# Altium schematic sheet solenoid.SchDoc
size A4
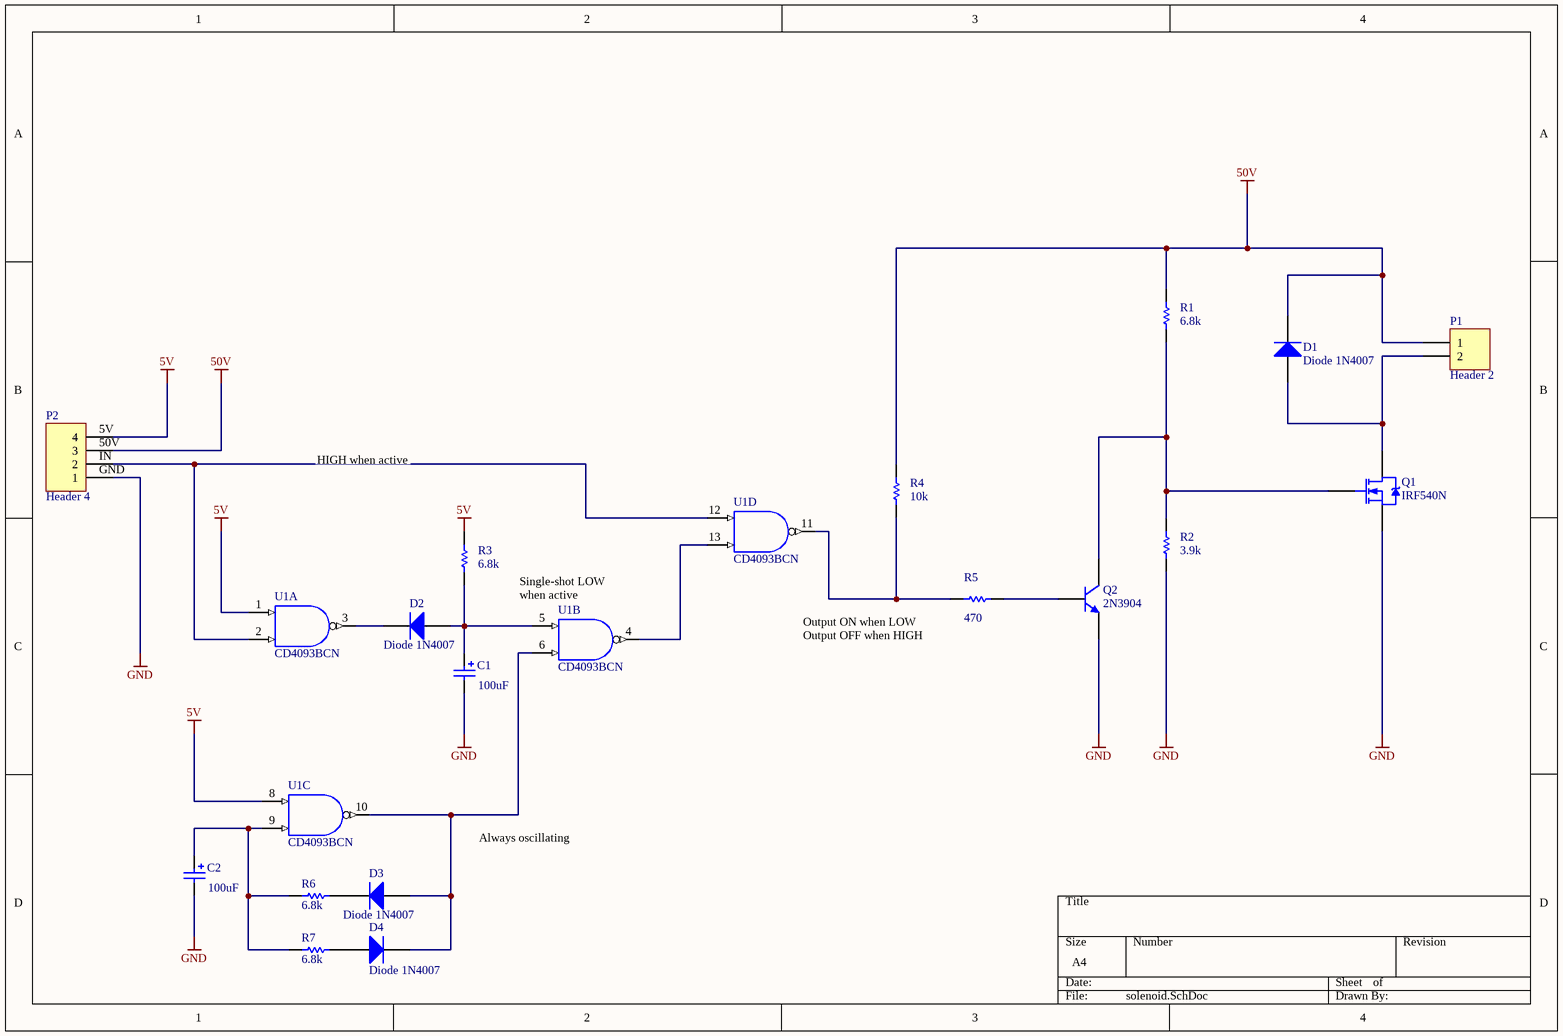
[diagram p0: solenoid.SchDoc]

## Parts
C1  value 100uF  [POLAR0.8]  (hidden comment: Cap Pol2)
C2  value 100uF  [POLAR0.8]  (hidden comment: Cap Pol2)
D1  Diode 1N4007  [DO-41]
D2  Diode 1N4007  [DO-41]
D3  Diode 1N4007  [DO-41]
D4  Diode 1N4007  [DO-41]
P1  Header 2  [HDR1X2]
P2  Header 4  [HDR1X4]
Q1  IRF540N  [TO-220AB]
Q2  2N3904  [TO-92A]
R1  value 6.8k  [AXIAL-0.3]  (hidden comment: Res1)
R2  value 3.9k  [AXIAL-0.3]  (hidden comment: Res1)
R3  value 6.8k  [AXIAL-0.3]  (hidden comment: Res1)
R4  value 10k  [AXIAL-0.3]  (hidden comment: Res1)
R5  value 470  [AXIAL-0.3]  (hidden comment: Res1)
R6  value 6.8k  [AXIAL-0.3]  (hidden comment: Res1)
R7  value 6.8k  [AXIAL-0.3]  (hidden comment: Res1)
U1  CD4093BCN  [N14A]  (parts A,B,C,D of 4)

## Nets
5V: P2.5V(4) R3.2 U1.1(A) U1.8(E)
50V: D1.2(K) P1.1 P2.50V(3) R1.2 R4.2
GND: C1.2 C2.2 P2.GND(1) Q1.3(S) Q2.1(E) R2.1 U1.7(GND)
VCC: U1.14(VCC)
NetC1_1: C1.1 D2.1(A) R3.1 U1.5(C)
NetC2_1: C2.1 R6.2 R7.2 U1.9(F)
NetD1_1: D1.1(A) P1.2 Q1.2(D)
NetD2_2: D2.2(K) U1.3(J)
NetD3_1: D3.1(A) D4.2(K) U1.6(D) U1.10(L)
NetD3_2: D3.2(K) R6.1
NetD4_1: D4.1(A) R7.1
NetP2_IN: P2.IN(2) U1.2(B) U1.12(G)
NetQ1_1: Q1.1(G) Q2.3(C) R1.1 R2.2
NetQ2_2: Q2.2(B) R5.1
NetR4_1: R4.1 R5.2 U1.11(M)
NetU1_4: U1.4(K) U1.13(H)

## Notes on the sheet
- HIGH when active
- (near U1) Single-shot LOW when active
- (near R5) Output ON when LOW
  Output OFF when HIGH
- Always oscillating

## Library data of the parts
C1 C2 = Cap Pol2: Polarized Capacitor (Axial); Published: 8-Jun-2000; LatestRevisionDate: 17-Jul-2002; LatestRevisionNote: Re-released for DXP Platform.; PackageReference: POLAR0.8; Publisher: Altium Limited; PackageDescription: Polarized Capacitor; 2 Leads
D1-D4 = Diode 1N4007: 1 Amp General Purpose Rectifier; Published: 8-Jun-2000; LatestRevisionDate: 17-Jul-2002; LatestRevisionNote: Re-released for DXP Platform.; DatasheetVersion: 1998; PackageVersion: Aug-1999; PackageReference: DO-41; Publisher: Altium Limited; PackageDescription: Diode, Axial; Body 5.2 x 2.7 mm (LxDia. max), Lead Dia. 0.86 mm (max); Code_JEDEC: DO-204-AL; ComponentLink1Description: Manufacturer Link; ComponentLink1URL: http://www.fairchildsemi.com/; ComponentLink2Description: Datasheet; ComponentLink2URL: http://www.fairchildsemi.com/ds/1N%2F1N4001.pdf
P1 = Header 2: Header, 2-Pin; LatestRevisionDate: 17-Jul-2002; LatestRevisionNote: Re-released for DXP Platform.; Publisher: Altium Limited
P2 = Header 4: Header, 4-Pin; LatestRevisionDate: 17-Jul-2002; LatestRevisionNote: Re-released for DXP Platform.; Publisher: Altium Limited
Q1 = IRF540N: HEXFET Power MOSFET; Note: Pin 2 is electrically connected to pin 4.; Sim Note: Thermal Model provided is not called on from main Subckt.; Published: 8-Jun-2000; LatestRevisionDate: 17-Jul-2002; LatestRevisionNote: Re-released for DXP Platform.; DatasheetVersion: May-1998; PackageVersion: Feb-1997; PackageReference: TO-220AB; Publisher: Altium Limited; PackageDescription: TO, Thru-Hole, Vertical, Heatsink Mounted; 3 In-Line Leads; Pitch 2.54 mm; ComponentLink1Description: Manufacturer Link; ComponentLink1URL: http://www.irf.com/; ComponentLink2Description: Datasheet; ComponentLink2URL: http://www.irf.com/product-info/datasheets/data/irf540n.pdf
Q2 = 2N3904: NPN General Purpose Amplifier; Published: 8-Jun-2000; LatestRevisionDate: 15-Jan-2003; LatestRevisionNote: PCB Footprint 'BCY-W3/D4.7' replaced; DatasheetVersion: 1997; PackageVersion: Sep-1998; PackageReference: TO-92A; Publisher: Altium Limited; PackageDescription: TO, Flat Index; 3 In-Line, Axial Leads; Body Dia. 4.5mm; Leads 0.51 x 0.48 mm (max); ComponentLink1Description: Manufacturer Link; ComponentLink1URL: http://www.fairchildsemi.com/; ComponentLink2Description: Datasheet; ComponentLink2URL: http://www.fairchildsemi.com/ds/2N%2F2N3904.pdf
R1-R7 = Res1: Resistor; Published: 8-Jun-2000; LatestRevisionDate: 17-Jul-2002; LatestRevisionNote: Re-released for DXP Platform.; PackageReference: AXIAL-0.3; Publisher: Altium Limited; PackageDescription: Axial Device, Thru-Hole; 2 Leads; 0.3 in Pin Spacing
U1 = CD4093BCN: Quad 2-Input Schmitt-Trigger NAND Gate, 14-Pin PDIP; IC_Technology: C; Published: 17-Jul-2002; LatestRevisionDate: 29-May-2009; LatestRevisionNote: Component Body Added.; DatasheetVersion: Jan-1999; PackageVersion: 2000; PackageReference: N14A; Publisher: Altium Limited; PackageDescription: DIP, 14-Pin, Row Spacing 7.62 mm, Pitch 2.54 mm; ComponentLink1Description: Manufacturer Link; ComponentLink1URL: http://www.fairchildsemi.com/; ComponentLink2Description: Datasheet; ComponentLink2URL: http://www.fairchildsemi.com/ds/CD%2FCD4093BC.pdf